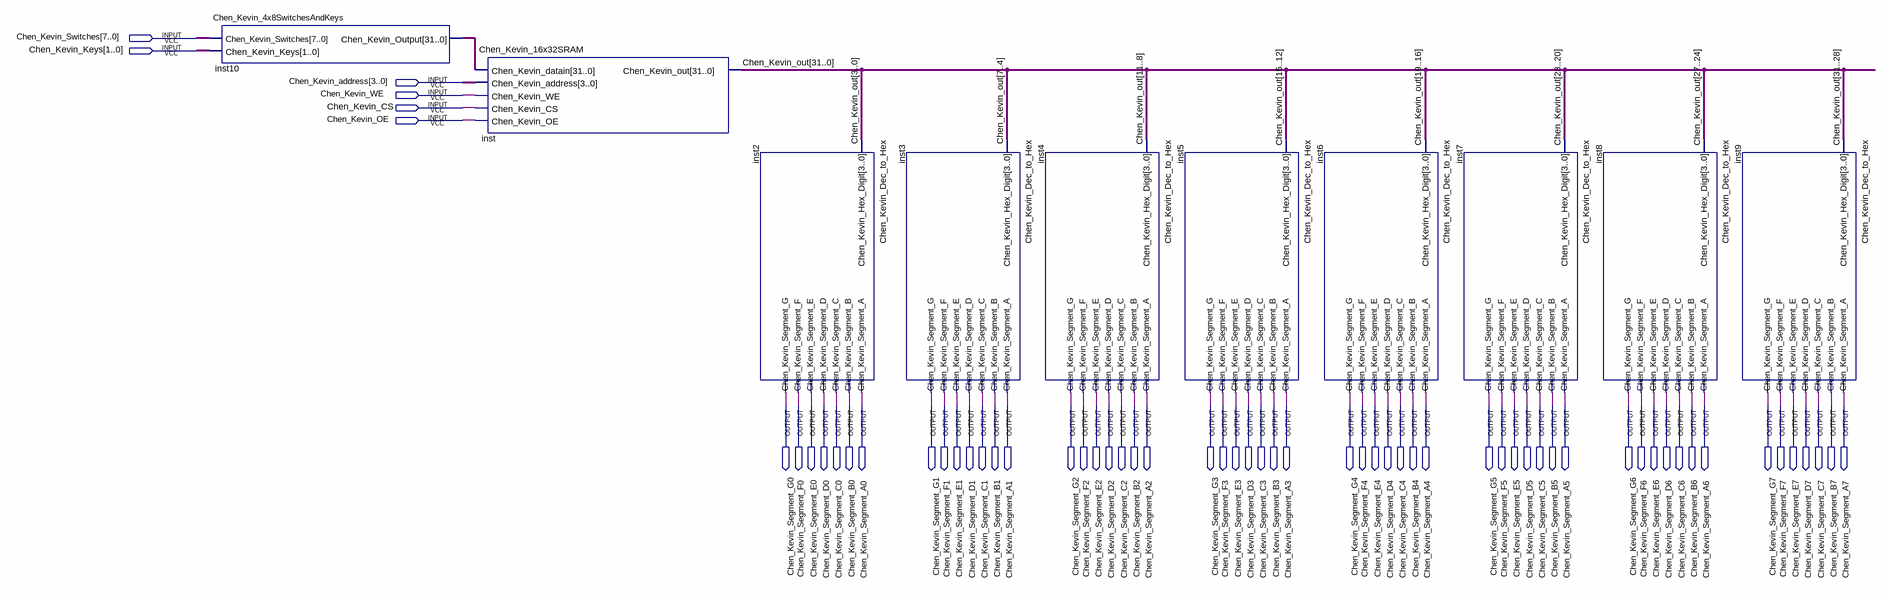
[diagram p0: schematic sheet]
// Quartus schematic Chen_Kevin_16x32SRAMFinal.bdf as structural Verilog: 10 symbols, 62 pins
module Chen_Kevin_16x32SRAMFinal (
  input  [7:0] Chen_Kevin_Switches,
  input  [1:0] Chen_Kevin_Keys,
  input  [3:0] Chen_Kevin_address,
  input  Chen_Kevin_WE,
  input  Chen_Kevin_CS,
  input  Chen_Kevin_OE,
  output Chen_Kevin_Segment_G0,
  output Chen_Kevin_Segment_F0,
  output Chen_Kevin_Segment_E0,
  output Chen_Kevin_Segment_D0,
  output Chen_Kevin_Segment_C0,
  output Chen_Kevin_Segment_B0,
  output Chen_Kevin_Segment_A0,
  output Chen_Kevin_Segment_G1,
  output Chen_Kevin_Segment_F1,
  output Chen_Kevin_Segment_E1,
  output Chen_Kevin_Segment_D1,
  output Chen_Kevin_Segment_C1,
  output Chen_Kevin_Segment_B1,
  output Chen_Kevin_Segment_A1,
  output Chen_Kevin_Segment_G2,
  output Chen_Kevin_Segment_F2,
  output Chen_Kevin_Segment_E2,
  output Chen_Kevin_Segment_D2,
  output Chen_Kevin_Segment_C2,
  output Chen_Kevin_Segment_B2,
  output Chen_Kevin_Segment_A2,
  output Chen_Kevin_Segment_G3,
  output Chen_Kevin_Segment_F3,
  output Chen_Kevin_Segment_E3,
  output Chen_Kevin_Segment_D3,
  output Chen_Kevin_Segment_C3,
  output Chen_Kevin_Segment_B3,
  output Chen_Kevin_Segment_A3,
  output Chen_Kevin_Segment_G4,
  output Chen_Kevin_Segment_F4,
  output Chen_Kevin_Segment_E4,
  output Chen_Kevin_Segment_D4,
  output Chen_Kevin_Segment_C4,
  output Chen_Kevin_Segment_B4,
  output Chen_Kevin_Segment_A4,
  output Chen_Kevin_Segment_G5,
  output Chen_Kevin_Segment_F5,
  output Chen_Kevin_Segment_E5,
  output Chen_Kevin_Segment_D5,
  output Chen_Kevin_Segment_C5,
  output Chen_Kevin_Segment_B5,
  output Chen_Kevin_Segment_A5,
  output Chen_Kevin_Segment_G6,
  output Chen_Kevin_Segment_F6,
  output Chen_Kevin_Segment_E6,
  output Chen_Kevin_Segment_D6,
  output Chen_Kevin_Segment_C6,
  output Chen_Kevin_Segment_B6,
  output Chen_Kevin_Segment_A6,
  output Chen_Kevin_Segment_G7,
  output Chen_Kevin_Segment_F7,
  output Chen_Kevin_Segment_E7,
  output Chen_Kevin_Segment_D7,
  output Chen_Kevin_Segment_C7,
  output Chen_Kevin_Segment_B7,
  output Chen_Kevin_Segment_A7
);

  wire [31:0] Chen_Kevin_out, inst10_chen_kevin_output;

  Chen_Kevin_4x8SwitchesAndKeys inst10 (
    .Chen_Kevin_Switches(Chen_Kevin_Switches), .Chen_Kevin_Keys(Chen_Kevin_Keys),
    .Chen_Kevin_Output(inst10_chen_kevin_output));
  Chen_Kevin_16x32SRAM inst (
    .Chen_Kevin_datain(inst10_chen_kevin_output), .Chen_Kevin_address(Chen_Kevin_address),
    .Chen_Kevin_WE(Chen_Kevin_WE), .Chen_Kevin_CS(Chen_Kevin_CS), .Chen_Kevin_OE(Chen_Kevin_OE),
    .Chen_Kevin_out(Chen_Kevin_out));
  Chen_Kevin_Dec_to_Hex inst2 (
    .Chen_Kevin_Hex_Digit(Chen_Kevin_out[3:0]), .Chen_Kevin_Segment_A(Chen_Kevin_Segment_A0),
    .Chen_Kevin_Segment_B(Chen_Kevin_Segment_B0), .Chen_Kevin_Segment_C(Chen_Kevin_Segment_C0),
    .Chen_Kevin_Segment_D(Chen_Kevin_Segment_D0), .Chen_Kevin_Segment_E(Chen_Kevin_Segment_E0),
    .Chen_Kevin_Segment_F(Chen_Kevin_Segment_F0), .Chen_Kevin_Segment_G(Chen_Kevin_Segment_G0));
  Chen_Kevin_Dec_to_Hex inst3 (
    .Chen_Kevin_Hex_Digit(Chen_Kevin_out[7:4]), .Chen_Kevin_Segment_A(Chen_Kevin_Segment_A1),
    .Chen_Kevin_Segment_B(Chen_Kevin_Segment_B1), .Chen_Kevin_Segment_C(Chen_Kevin_Segment_C1),
    .Chen_Kevin_Segment_D(Chen_Kevin_Segment_D1), .Chen_Kevin_Segment_E(Chen_Kevin_Segment_E1),
    .Chen_Kevin_Segment_F(Chen_Kevin_Segment_F1), .Chen_Kevin_Segment_G(Chen_Kevin_Segment_G1));
  Chen_Kevin_Dec_to_Hex inst4 (
    .Chen_Kevin_Hex_Digit(Chen_Kevin_out[11:8]), .Chen_Kevin_Segment_A(Chen_Kevin_Segment_A2),
    .Chen_Kevin_Segment_B(Chen_Kevin_Segment_B2), .Chen_Kevin_Segment_C(Chen_Kevin_Segment_C2),
    .Chen_Kevin_Segment_D(Chen_Kevin_Segment_D2), .Chen_Kevin_Segment_E(Chen_Kevin_Segment_E2),
    .Chen_Kevin_Segment_F(Chen_Kevin_Segment_F2), .Chen_Kevin_Segment_G(Chen_Kevin_Segment_G2));
  Chen_Kevin_Dec_to_Hex inst5 (
    .Chen_Kevin_Hex_Digit(Chen_Kevin_out[15:12]), .Chen_Kevin_Segment_A(Chen_Kevin_Segment_A3),
    .Chen_Kevin_Segment_B(Chen_Kevin_Segment_B3), .Chen_Kevin_Segment_C(Chen_Kevin_Segment_C3),
    .Chen_Kevin_Segment_D(Chen_Kevin_Segment_D3), .Chen_Kevin_Segment_E(Chen_Kevin_Segment_E3),
    .Chen_Kevin_Segment_F(Chen_Kevin_Segment_F3), .Chen_Kevin_Segment_G(Chen_Kevin_Segment_G3));
  Chen_Kevin_Dec_to_Hex inst6 (
    .Chen_Kevin_Hex_Digit(Chen_Kevin_out[19:16]), .Chen_Kevin_Segment_A(Chen_Kevin_Segment_A4),
    .Chen_Kevin_Segment_B(Chen_Kevin_Segment_B4), .Chen_Kevin_Segment_C(Chen_Kevin_Segment_C4),
    .Chen_Kevin_Segment_D(Chen_Kevin_Segment_D4), .Chen_Kevin_Segment_E(Chen_Kevin_Segment_E4),
    .Chen_Kevin_Segment_F(Chen_Kevin_Segment_F4), .Chen_Kevin_Segment_G(Chen_Kevin_Segment_G4));
  Chen_Kevin_Dec_to_Hex inst7 (
    .Chen_Kevin_Hex_Digit(Chen_Kevin_out[23:20]), .Chen_Kevin_Segment_A(Chen_Kevin_Segment_A5),
    .Chen_Kevin_Segment_B(Chen_Kevin_Segment_B5), .Chen_Kevin_Segment_C(Chen_Kevin_Segment_C5),
    .Chen_Kevin_Segment_D(Chen_Kevin_Segment_D5), .Chen_Kevin_Segment_E(Chen_Kevin_Segment_E5),
    .Chen_Kevin_Segment_F(Chen_Kevin_Segment_F5), .Chen_Kevin_Segment_G(Chen_Kevin_Segment_G5));
  Chen_Kevin_Dec_to_Hex inst8 (
    .Chen_Kevin_Hex_Digit(Chen_Kevin_out[27:24]), .Chen_Kevin_Segment_A(Chen_Kevin_Segment_A6),
    .Chen_Kevin_Segment_B(Chen_Kevin_Segment_B6), .Chen_Kevin_Segment_C(Chen_Kevin_Segment_C6),
    .Chen_Kevin_Segment_D(Chen_Kevin_Segment_D6), .Chen_Kevin_Segment_E(Chen_Kevin_Segment_E6),
    .Chen_Kevin_Segment_F(Chen_Kevin_Segment_F6), .Chen_Kevin_Segment_G(Chen_Kevin_Segment_G6));
  Chen_Kevin_Dec_to_Hex inst9 (
    .Chen_Kevin_Hex_Digit(Chen_Kevin_out[31:28]), .Chen_Kevin_Segment_A(Chen_Kevin_Segment_A7),
    .Chen_Kevin_Segment_B(Chen_Kevin_Segment_B7), .Chen_Kevin_Segment_C(Chen_Kevin_Segment_C7),
    .Chen_Kevin_Segment_D(Chen_Kevin_Segment_D7), .Chen_Kevin_Segment_E(Chen_Kevin_Segment_E7),
    .Chen_Kevin_Segment_F(Chen_Kevin_Segment_F7), .Chen_Kevin_Segment_G(Chen_Kevin_Segment_G7));
endmodule
